# EAGLE schematic schmatic (EAGLE 9.6.2)

## Sheet 1 of 5
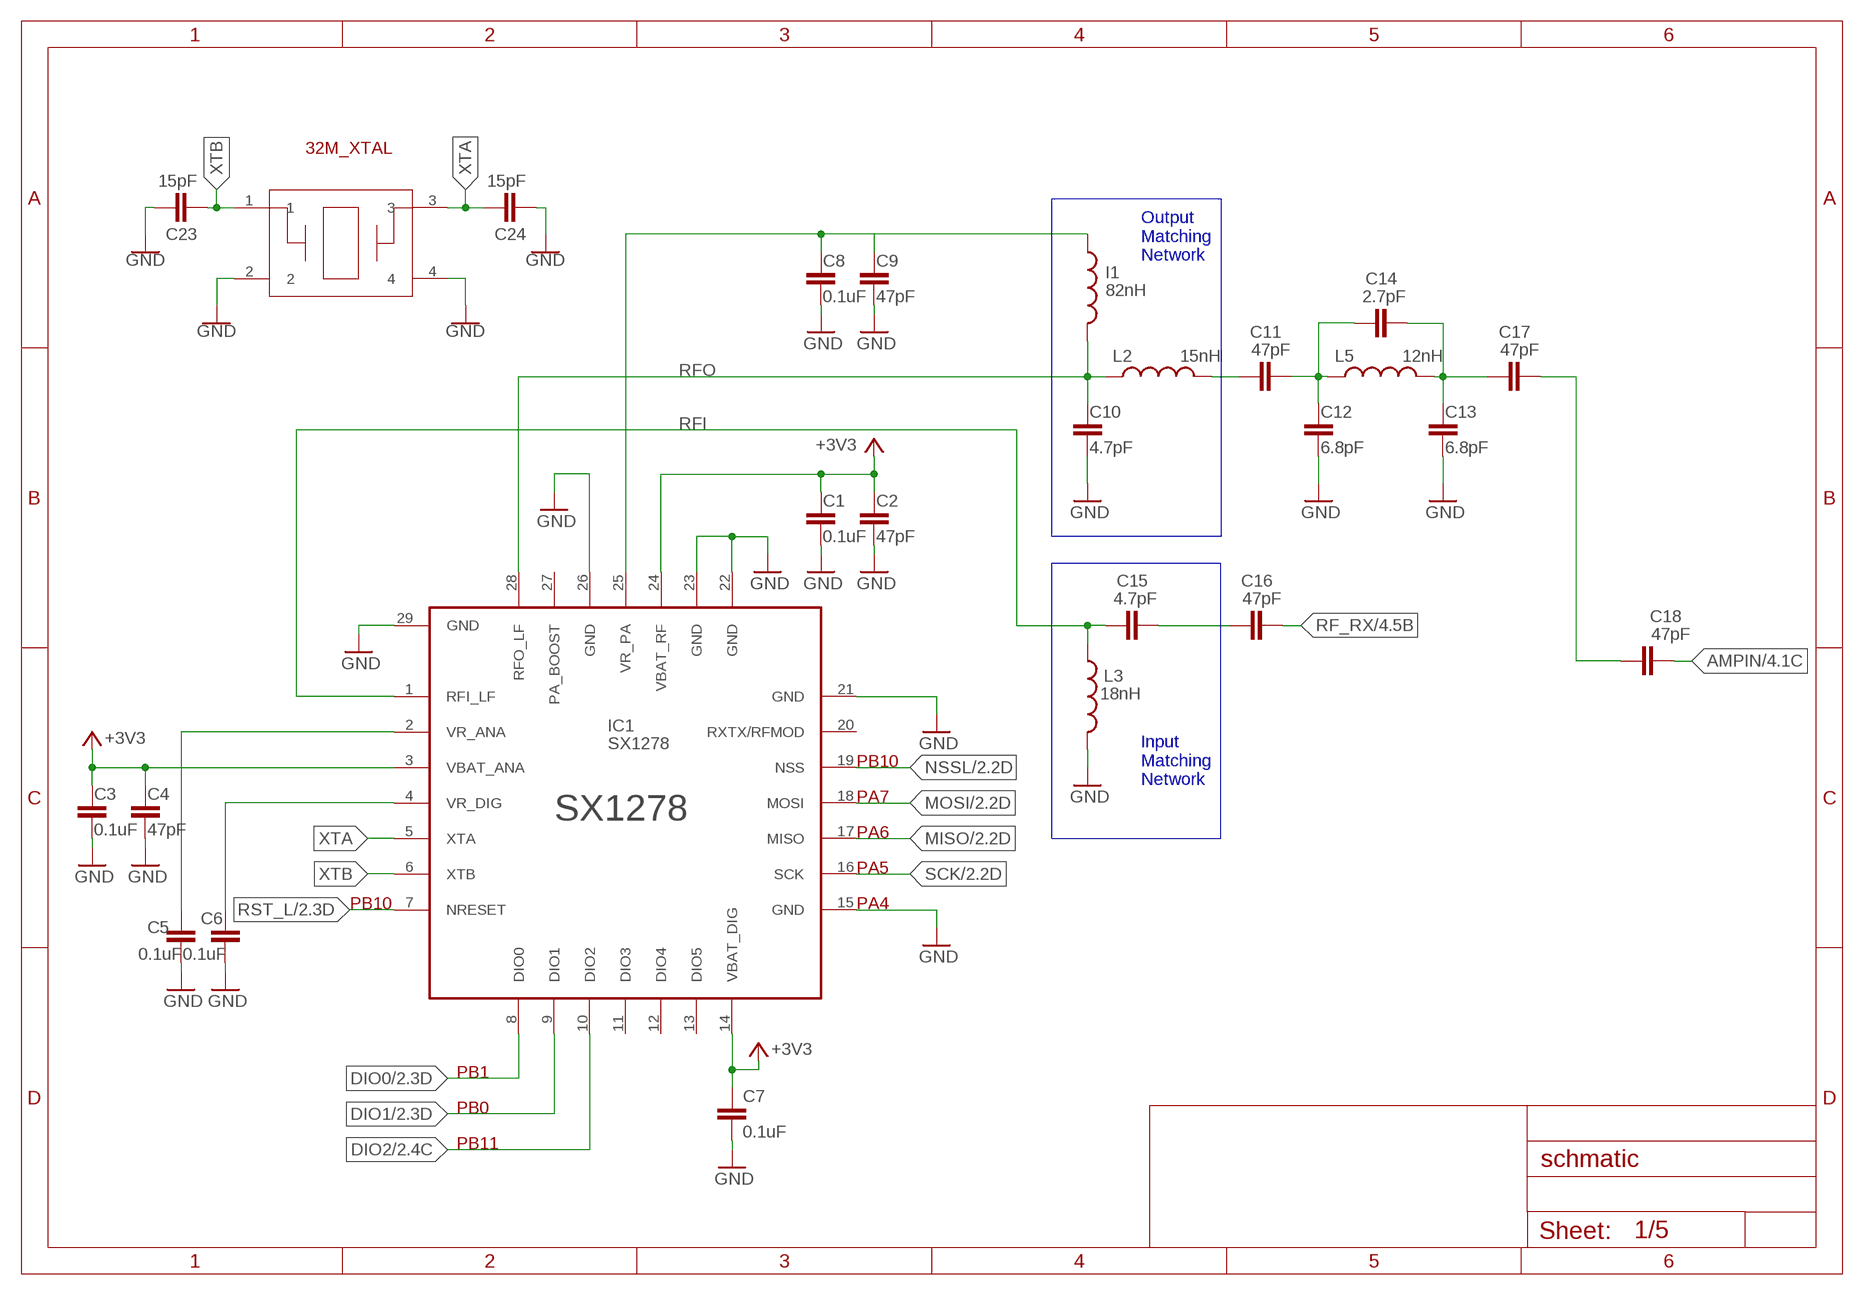
[diagram p0: schematic, sheet 1]

### Parts
C1  0.1uF  CAPACITOR  [M(1005)_US(0402)]
C2  47pF  CAPACITOR  [M(1005)_US(0402)]
C3  0.1uF  CAPACITOR  [M(1005)_US(0402)]
C4  47pF  CAPACITOR  [M(1005)_US(0402)]
C5  0.1uF  CAPACITOR  [M(1005)_US(0402)]
C6  0.1uF  CAPACITOR  [M(1005)_US(0402)]
C7  0.1uF  CAPACITOR  [M(1005)_US(0402)]
C8  0.1uF  CAPACITOR  [M(1005)_US(0402)]
C9  47pF  CAPACITOR  [M(1005)_US(0402)]
C10  4.7pF  CAPACITOR  [M(1005)_US(0402)]
C11  47pF  CAPACITOR  [M(1005)_US(0402)]
C12  6.8pF  CAPACITOR  [M(1005)_US(0402)]
C13  6.8pF  CAPACITOR  [M(1005)_US(0402)]
C14  2.7pF  CAPACITOR  [M(1005)_US(0402)]
C15  4.7pF  CAPACITOR  [M(1005)_US(0402)]
C16  47pF  CAPACITOR  [M(1005)_US(0402)]
C17  47pF  CAPACITOR  [M(1005)_US(0402)]
C18  47pF  CAPACITOR  [M(1005)_US(0402)]
C23  15pF  CAP_(M1005)_0402  [CAP_(M1005)_0402]
C24  15pF  CAP_(M1005)_0402  [CAP_(M1005)_0402]
I1  82nH  INDUCTOR1608  [M(1608)_US(0603)]
IC1  SX1278  [SX1278]
L2  15nH  INDUCTOR  [M(1005)_US(0402)]
L3  18nH  INDUCTOR  [M(1005)_US(0402)]
L5  12nH  INDUCTOR  [M(1005)_US(0402)]
Q1  NX2520SA-32MHZ  [NX2520SA]

### Nets
+3V1: C5.1 IC1.2(VR_ANA)
+3V2: C6.1 IC1.4(VR_DIG)
+3V3: C1.1 C2.1 C3.1 C4.1 C7.1 IC1.3(VBAT_ANA) IC1.14(VBAT_DIG) IC1.24(VBAT_RF) ; also sheet 2,3,4,5
+3V4: C8.1 C9.1 I1.1 IC1.25(VR_PA)
AMPIN: C18.2 ; also sheet 4
DIO0: IC1.8(DIO0) ; also sheet 2
DIO1: IC1.9(DIO1) ; also sheet 2
DIO2: IC1.10(DIO2) ; also sheet 2
GND: C1.2 C2.2 C3.2 C4.2 C5.2 C6.2 C7.2 C8.2 C9.2 C10.2 C12.2 C13.2 C23.1 C24.2 IC1.15(GND) IC1.21(GND) IC1.22(GND) IC1.23(GND) IC1.26(GND) IC1.29(GND) L3.2 Q1.2 Q1.4 ; also sheet 2,3,4,5
MISO: IC1.17(MISO) ; also sheet 2,3
MOSI: IC1.18(MOSI) ; also sheet 2,3
N$1: C11.1 L2.2
N$2: C11.2 C12.1 C14.1 L5.1
N$3: C13.1 C14.2 C17.1 L5.2
N$5: C15.2 C16.1
N$6: C17.2 C18.1
NSSL: IC1.19(NSS) ; also sheet 2
RF_RX: C16.2 ; also sheet 4
RFI: C15.1 IC1.1(RFI_LF) L3.1
RFO: C10.1 I1.2 IC1.28(RFO_LF) L2.1
RST_L: IC1.7(NRESET) ; also sheet 2
SCK: IC1.16(SCK) ; also sheet 2,3
XTA: C24.1 IC1.5(XTA) Q1.3
XTB: C23.2 IC1.6(XTB) Q1.1
Unconnected: IC1.11(DIO3) IC1.12(DIO4) IC1.13(DIO5) IC1.20(RXTX/RFMOD) IC1.27(PA_BOOST)

### Buses
B$1
B$2

### Notes on the sheet
- 32M_XTAL
- Output
  Matching
  Network
- PB10
- Input
  Matching
  Network
- PA7
- PA6
- PA5
- PB10 | PA4
- PB1
- PB0
- PB11

## Sheet 2 of 5
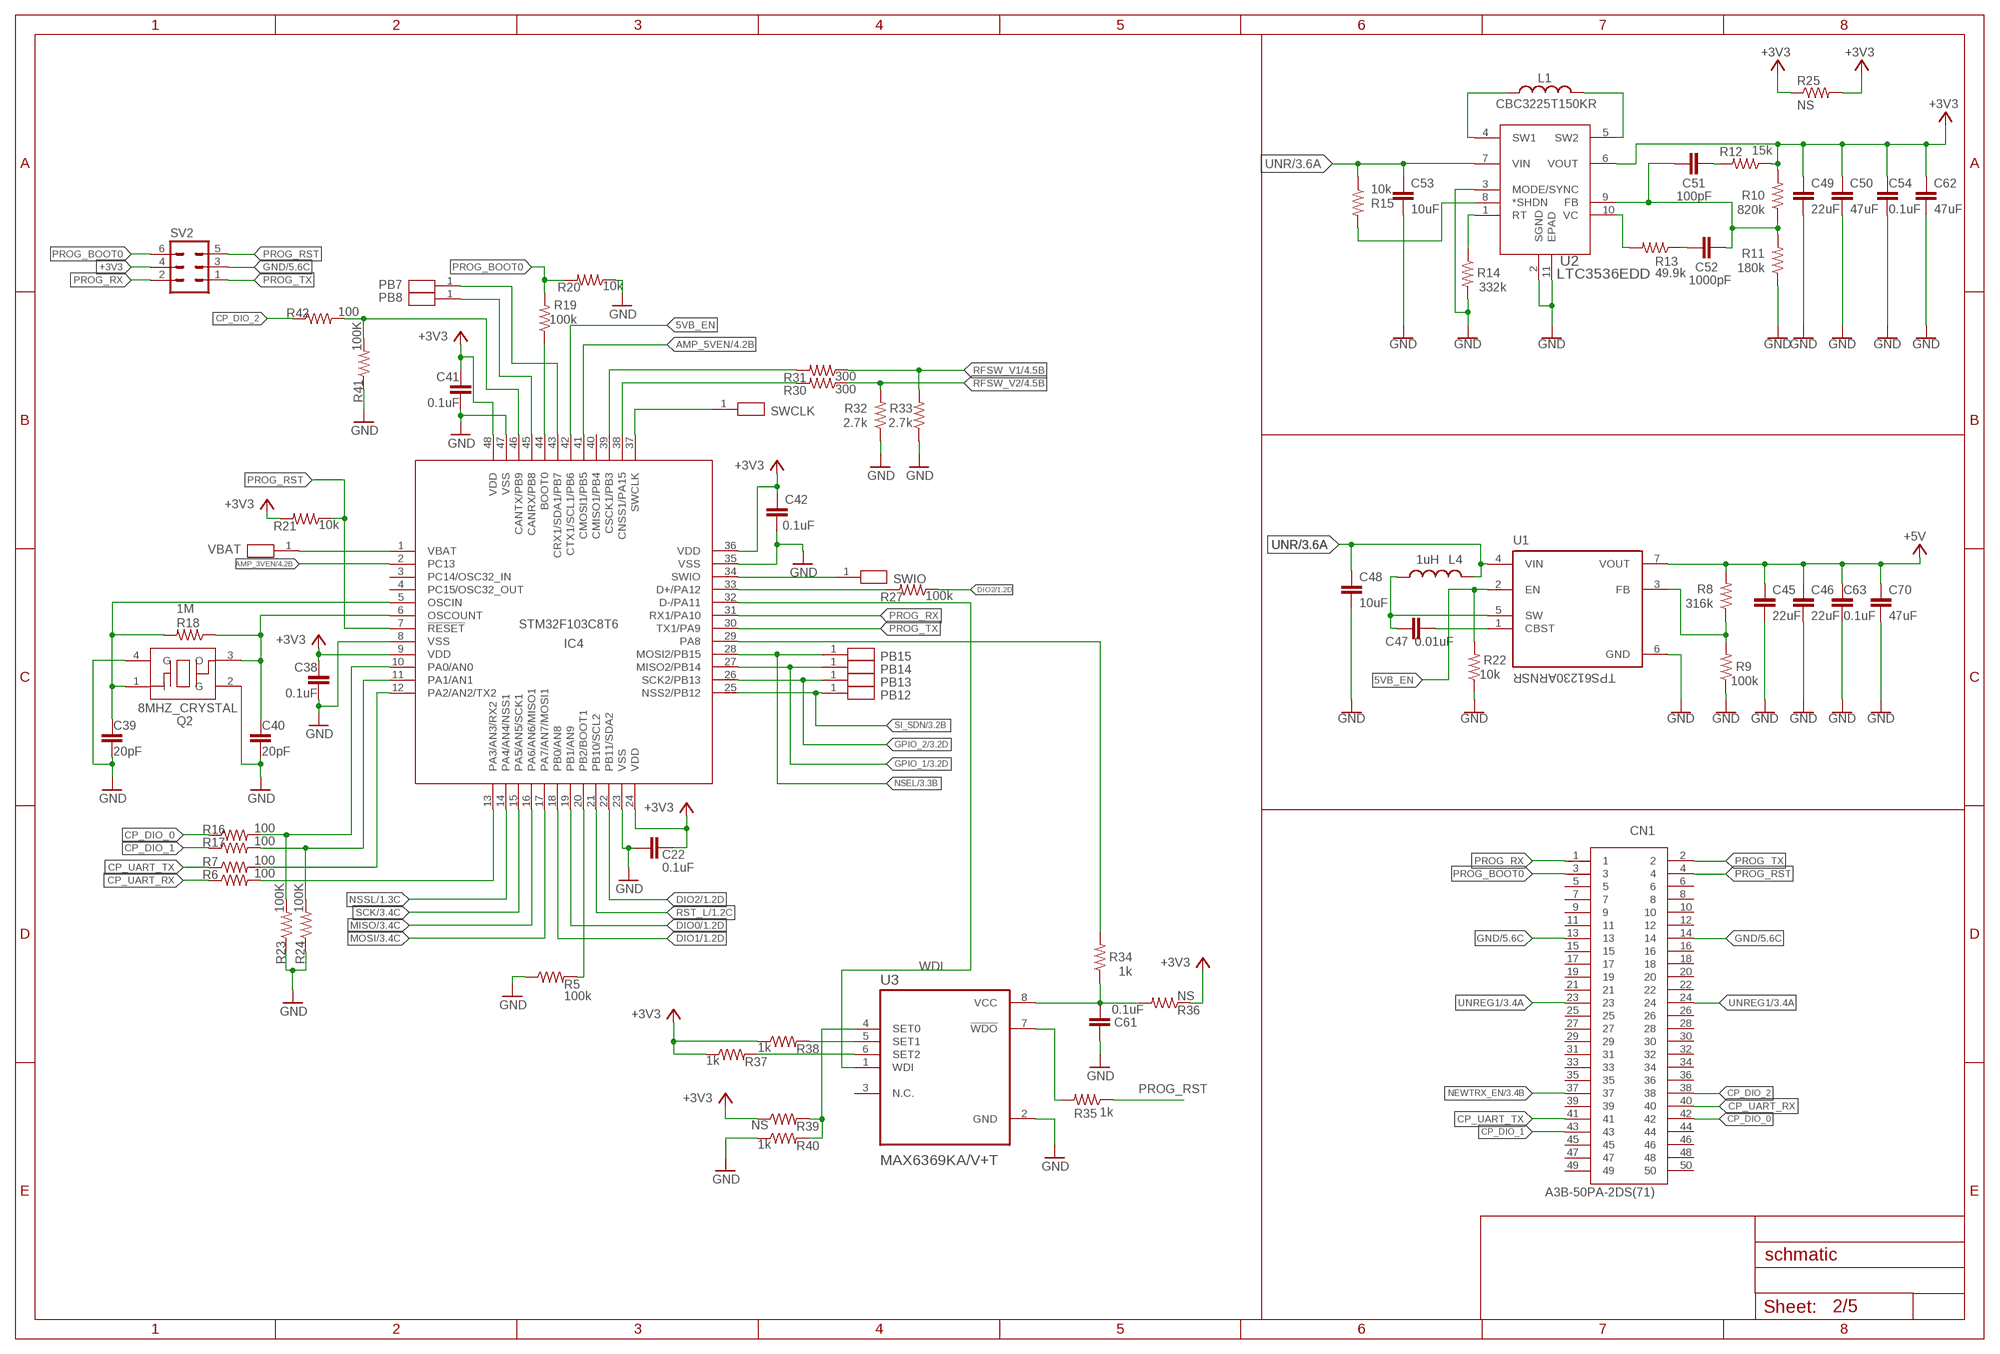
[diagram p1: schematic, sheet 2]

### Parts
C22  0.1uF  CAPACITOR  [M(1005)_US(0402)]
C38  0.1uF  CAPACITOR  [M(1005)_US(0402)]
C39  20pF  CAPACITOR  [M(1005)_US(0402)]
C40  20pF  CAPACITOR  [M(1005)_US(0402)]
C41  0.1uF  CAPACITOR  [M(1005)_US(0402)]
C42  0.1uF  CAPACITOR  [M(1005)_US(0402)]
C45  22uF  CAPACITOR1608  [M(1608)_US(0603)]
C46  22uF  CAPACITOR1608  [M(1608)_US(0603)]
C47  0.01uF  CAPACITOR  [M(1005)_US(0402)]
C48  10uF  CAPACITOR1608  [M(1608)_US(0603)]
C49  22uF  CAPACITOR1608  [M(1608)_US(0603)]
C50  47uF  CAPACITOR2012  [M(2012)_US(0805)]
C51  100pF  CAPACITOR  [M(1005)_US(0402)]
C52  1000pF  CAPACITOR  [M(1005)_US(0402)]
C53  10uF  CAPACITOR1608  [M(1608)_US(0603)]
C54  0.1uF  CAPACITOR  [M(1005)_US(0402)]
C61  0.1uF  CAPACITOR  [M(1005)_US(0402)]
C62  47uF  CAPACITOR2012  [M(2012)_US(0805)]
C63  0.1uF  CAPACITOR  [M(1005)_US(0402)]
C70  47uF  CAPACITOR2012  [M(2012)_US(0805)]
CN1  A3B-50PA-2DS(71)  [A3B-50PA-2DS(71)]
IC4  STM32F103C8T6  [STM32F103C8T6]
L1  CBC3225T150KR  INDUCTOR3225  [M(3225)_US(1210)]
L4  1uH  AMDLA3020S-1R5MT  [AMDLA3020S-1R5MT]
PB7  TEST_POINT  [TEST_POINT_1.5MM]
PB8  TEST_POINT  [TEST_POINT_1.5MM]
PB12  TEST_POINT  [TEST_POINT_1.5MM]
PB13  TEST_POINT  [TEST_POINT_1.5MM]
PB14  TEST_POINT  [TEST_POINT_1.5MM]
PB15  TEST_POINT  [TEST_POINT_1.5MM]
Q2  8MHZ_CRYSTAL  [ECS-80-18-30B-JEM-TR]
R5  100k  RESISTOR  [M(1005)_US(0402)]
R6  100  RESISTOR  [M(1005)_US(0402)]
R7  100  RESISTOR  [M(1005)_US(0402)]
R8  316k  RESISTOR1608  [M(1608)_US(0603)]
R9  100k  RESISTOR1608  [M(1608)_US(0603)]
R10  820k  RESISTOR1608  [M(1608)_US(0603)]
R11  180k  RESISTOR1608  [M(1608)_US(0603)]
R12  15k  RESISTOR1608  [M(1608)_US(0603)]
R13  49.9k  RESISTOR1608  [M(1608)_US(0603)]
R14  332k  RESISTOR1608  [M(1608)_US(0603)]
R15  10k  RESISTOR  [M(1005)_US(0402)]
R16  100  RESISTOR  [M(1005)_US(0402)]
R17  100  RESISTOR  [M(1005)_US(0402)]
R18  1M  RESISTOR1608  [M(1608)_US(0603)]
R19  100k  RESISTOR  [M(1005)_US(0402)]
R20  10k  RESISTOR  [M(1005)_US(0402)]
R21  10k  RESISTOR  [M(1005)_US(0402)]
R22  10k  RESISTOR  [M(1005)_US(0402)]
R23  100K  RESISTOR  [M(1005)_US(0402)]
R24  100K  RESISTOR  [M(1005)_US(0402)]
R25  NS  RESISTOR2012  [M(2012)_US(0805)]
R27  100k  RESISTOR  [M(1005)_US(0402)]
R30  300  RESISTOR1608  [M(1608)_US(0603)]
R31  300  RESISTOR1608  [M(1608)_US(0603)]
R32  2.7k  RESISTOR1608  [M(1608)_US(0603)]
R33  2.7k  RESISTOR1608  [M(1608)_US(0603)]
R34  1k  RESISTOR1608  [M(1608)_US(0603)]
R35  1k  RESISTOR1608  [M(1608)_US(0603)]
R36  NS  RESISTOR1608  [M(1608)_US(0603)]
R37  1k  RESISTOR  [M(1005)_US(0402)]
R38  1k  RESISTOR  [M(1005)_US(0402)]
R39  NS  RESISTOR  [M(1005)_US(0402)]
R40  1k  RESISTOR  [M(1005)_US(0402)]
R41  100K  RESISTOR  [M(1005)_US(0402)]
R42  100  RESISTOR  [M(1005)_US(0402)]
SV2  MA03-2  [MA03-2]
SWCLK  TEST_POINT  [TEST_POINT_1.5MM]
SWIO  TEST_POINT  [TEST_POINT_1.5MM]
U1  TPS61230ARNSR  [IC_TPS61230ARNSR]
U2  LTC3536EDD  LTC3536EDD#TRPBF  [DFN-10_DD]
U3  MAX6369KA/V+T  [SOT65P280X145-8N]
VBAT  TEST_POINT  [TEST_POINT_1.5MM]

### Nets
5VB_EN: IC4.42(CTX1/SCL1/PB6) R22.2 U1.2(EN)
+3V3: C22.1 C38.1 C41.1 C42.1 C49.1 C50.1 C54.1 C62.1 IC4.9(VDD) IC4.24(VDD) IC4.36(VDD) IC4.48(VDD) R10.2 R12.1 R21.2 R25.1 R25.2 R36.1 R37.1 R38.1 R39.1 SV2.4 U2.6(VOUT) ; also sheet 1,3,4,5
+5V: C45.1 C46.1 C63.1 C70.1 R8.2 U1.7(VOUT) ; also sheet 4
AMP_3VEN: IC4.2(PC13) ; also sheet 4
AMP_5VEN: IC4.41(CMOSI1/PB5) ; also sheet 4
C_UART_RX: IC4.13(PA3/AN3/RX2) R6.2
C_UART_TX: IC4.12(PA2/AN2/TX2) R7.2
CP_DIO_0: CN1.42 R16.1
CP_DIO_1: CN1.43 R17.1
CP_DIO_2: CN1.38 R42.1
CP_UART_RX: CN1.40 R6.1
CP_UART_TX: CN1.41 R7.1
DIO0: IC4.19(PB1/AN9) ; also sheet 1
DIO1: IC4.18(PB0/AN8) ; also sheet 1
DIO2: IC4.22(PB11/SDA2) R27.1 ; also sheet 1
GND: C22.2 C38.2 C39.2 C40.2 C41.2 C42.2 C45.2 C46.2 C48.2 C49.2 C50.2 C53.2 C54.2 C61.2 C62.2 C63.2 C70.2 CN1.13 CN1.14 IC4.8(VSS) IC4.23(VSS) IC4.35(VSS) IC4.47(VSS) Q2.2(G) Q2.4(G) R5.1 R9.1 R11.1 R14.2 R20.1 R22.1 R23.1 R24.1 R32.1 R33.1 R40.1 R41.1 SV2.3 U1.6(GND) U2.2(SGND) U2.3(MODE/SYNC) U2.11(EPAD) U3.2(GND) ; also sheet 1,3,4,5
GPIO_1: IC4.27(MISO2/PB14) PB14.1 ; also sheet 3
GPIO_2: IC4.26(SCK2/PB13) PB13.1 ; also sheet 3
MISO: IC4.16(PA6/AN6/MISO1) ; also sheet 1,3
MOSI: IC4.17(PA7/AN7/MOSI1) ; also sheet 1,3
N$17: IC4.38(CNSS1/PA15) R30.2
N$21: C61.1 R34.1 R36.2 U3.8(VCC)
N$24: IC4.10(PA0/AN0) R16.2 R23.2
N$25: IC4.20(PB2/BOOT1) R5.2
N$26: IC4.11(PA1/AN1) R17.2 R24.2
N$27: R35.2 U3.7(!WDO)
N$28: C39.1 IC4.5(OSCIN) Q2.1(I) R18.2
N$29: C40.1 IC4.6(OSCOUNT) Q2.3(O) R18.1
N$30: L1.1 U2.4(SW1)
N$31: R8.1 R9.2 U1.3(FB)
N$32: C47.1 L4.1 U1.5(SW)
N$33: L1.2 U2.5(SW2)
N$34: C47.2 U1.1(CBST)
N$35: IC4.1(VBAT) VBAT.1
N$36: C51.2 R12.2
N$37: C51.1 C52.2 R10.1 R11.2 U2.9(FB)
N$38: IC4.44(BOOT0) R19.1
N$39: C52.1 R13.1
N$40: R13.2 U2.10(VC)
N$41: R14.1 U2.1(RT)
N$42: R38.2 U3.5(SET1)
N$43: IC4.39(CSCK1/PB3) R31.2
N$44: R37.2 U3.6(SET2)
N$45: R39.2 R40.2 U3.4(SET0)
N$48: IC4.33(D+/PA12) R27.2
N$50: IC4.29(PA8) R34.2
NEWTRX_EN: CN1.37 ; also sheet 3
NSEL: IC4.28(MOSI2/PB15) PB15.1 ; also sheet 3
NSSL: IC4.14(PA4/AN4/NSS1) ; also sheet 1
NTRX_EN: R15.2 U2.8(*SHDN)
PB7: IC4.43(CRX1/SDA1/PB7) PB7.1
PB8: IC4.45(CANRX/PB8) PB8.1
PB9: IC4.46(CANTX/PB9) R41.2 R42.2
PROG_BOOT0: CN1.3 R19.2 R20.2 SV2.6
PROG_RST: CN1.4 IC4.7(!RESET) R21.1 R35.1 SV2.5
PROG_RX: CN1.1 IC4.31(RX1/PA10) SV2.2
PROG_TX: CN1.2 IC4.30(TX1/PA9) SV2.1
RFSW_V1: R31.1 R33.2 ; also sheet 4
RFSW_V2: R30.1 R32.2 ; also sheet 4
RST_L: IC4.21(PB10/SCL2) ; also sheet 1
SCK: IC4.15(PA5/AN5/SCK1) ; also sheet 1,3
SI_SDN: IC4.25(NSS2/PB12) PB12.1 ; also sheet 3
SWCLK: IC4.37(SWCLK) SWCLK.1
SWIO: IC4.34(SWIO) SWIO.1
UNR: C48.1 C53.1 L4.2 R15.1 U1.4(VIN) U2.7(VIN) ; also sheet 3
UNREG1: CN1.23 CN1.24 ; also sheet 3
WDI: IC4.32(D-/PA11) U3.1(WDI)
Unconnected: CN1.5 CN1.6 CN1.7 CN1.8 CN1.9 CN1.10 CN1.11 CN1.12 CN1.15 CN1.16 CN1.17 CN1.18 CN1.19 CN1.20 CN1.21 CN1.22 CN1.25 CN1.26 CN1.27 CN1.28 CN1.29 CN1.30 CN1.31 CN1.32 CN1.33 CN1.34 CN1.35 CN1.36 CN1.39 CN1.44 CN1.45 CN1.46 CN1.47 CN1.48 CN1.49 CN1.50 IC4.3(PC14/OSC32_IN) IC4.4(PC15/OSC32_OUT) IC4.40(CMISO1/PB4) U3.3(N.C.)

## Sheet 3 of 5
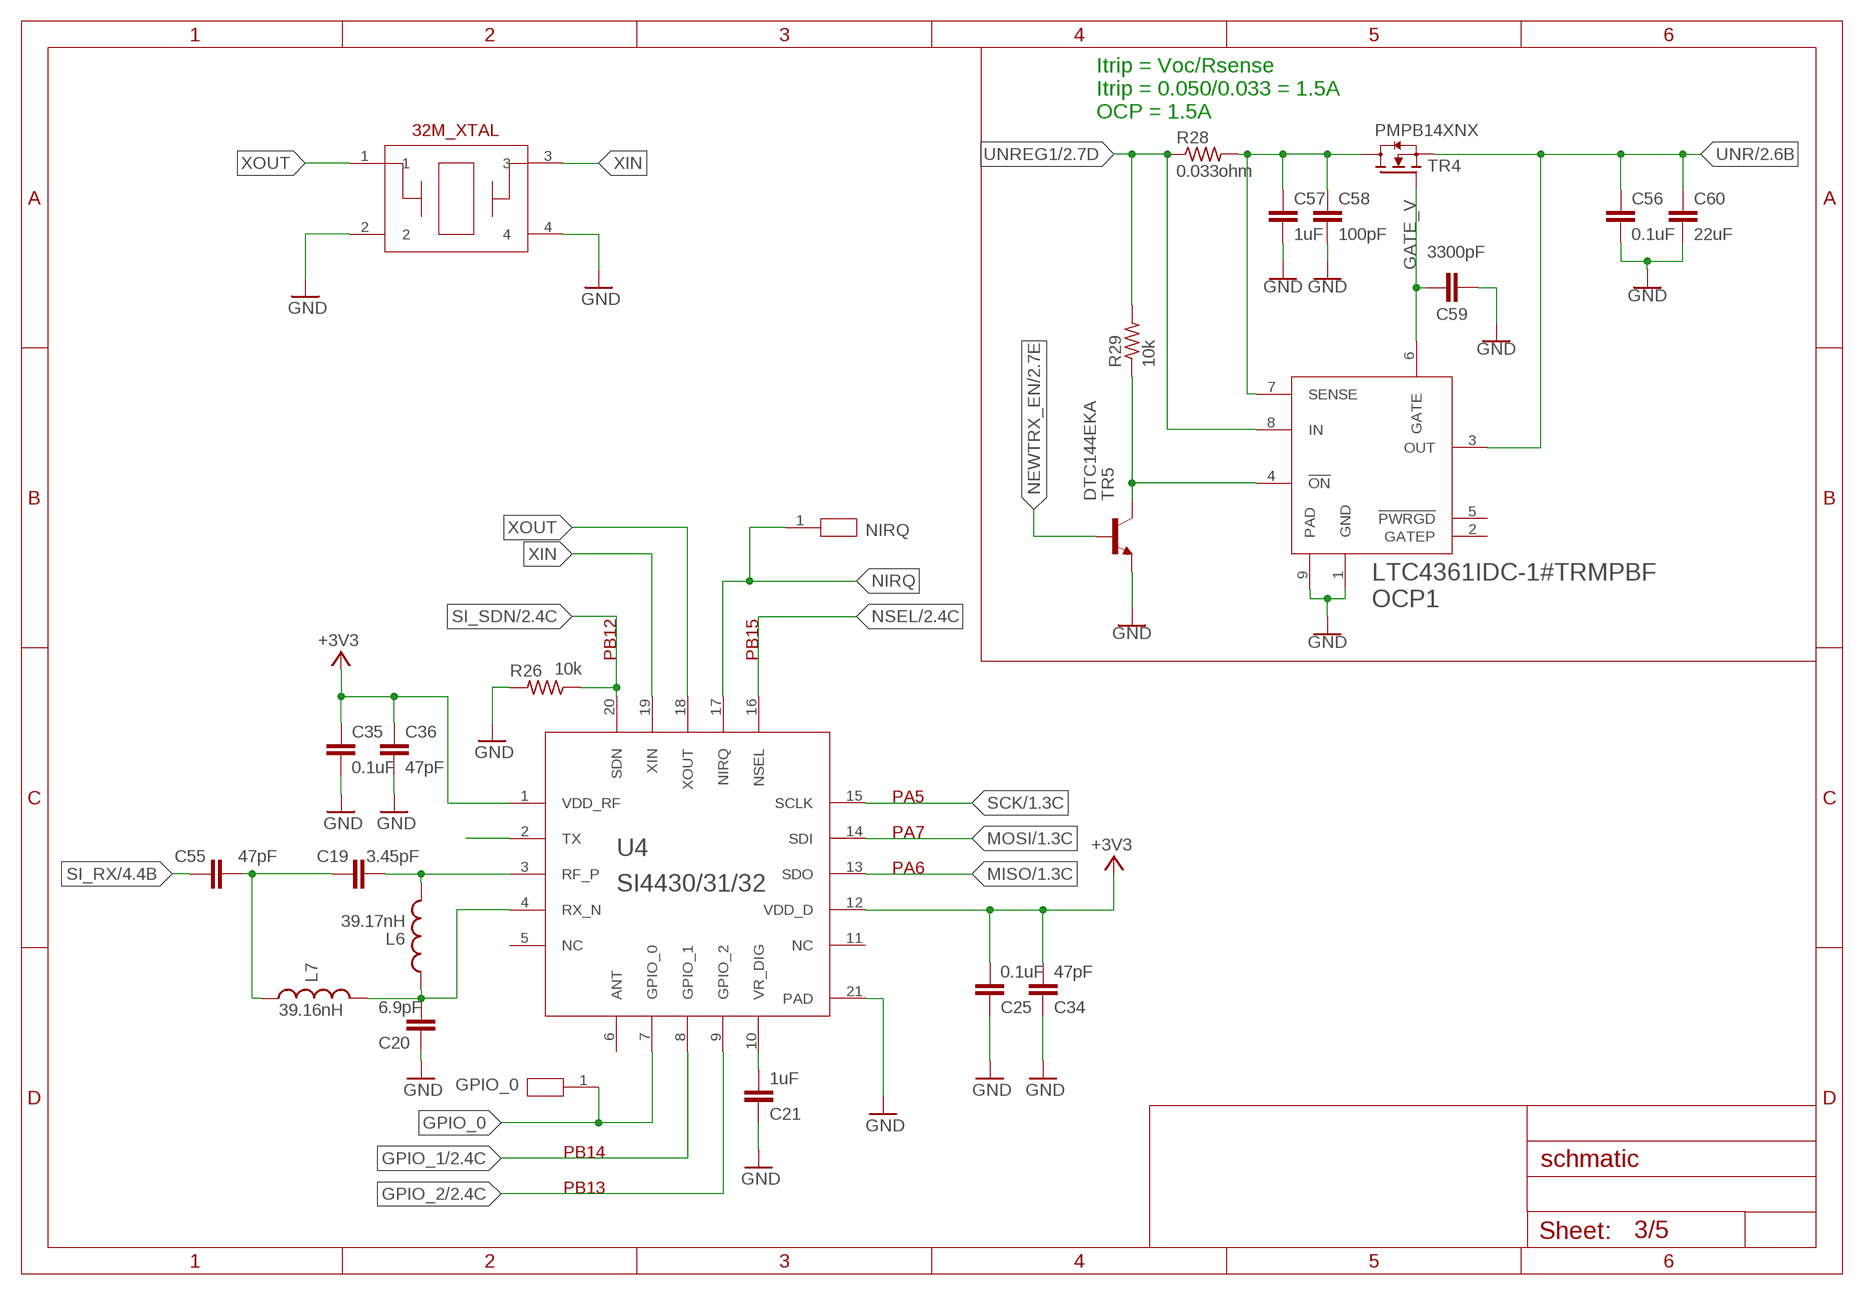
[diagram p2: schematic, sheet 3]

### Parts
C19  3.45pF  CAPACITOR  [M(1005)_US(0402)]
C20  6.9pF  CAPACITOR  [M(1005)_US(0402)]
C21  1uF  CAPACITOR  [M(1005)_US(0402)]
C25  0.1uF  CAPACITOR  [M(1005)_US(0402)]
C34  47pF  CAPACITOR  [M(1005)_US(0402)]
C35  0.1uF  CAPACITOR1608  [M(1608)_US(0603)]
C36  47pF  CAPACITOR1608  [M(1608)_US(0603)]
C55  47pF  CAPACITOR  [M(1005)_US(0402)]
C56  0.1uF  CAP_(M1005)_0402  [CAP_(M1005)_0402]
C57  1uF  CAP_(M1005)_0402  [CAP_(M1005)_0402]
C58  100pF  CAP_(M1005)_0402  [CAP_(M1005)_0402]
C59  3300pF  CAP_(M1005)_0402  [CAP_(M1005)_0402]
C60  22uF  CAPACITOR1608  [M(1608)_US(0603)]
GPIO_0  TEST_POINT  [TEST_POINT_1.5MM]
L6  39.17nH  INDUCTOR  [M(1005)_US(0402)]
L7  39.16nH  INDUCTOR  [M(1005)_US(0402)]
NIRQ  TEST_POINT  [TEST_POINT_1.5MM]
OCP1  LTC4361IDC-1#TRMPBF  [LTC4361IDC-1#TRMPBF]
Q3  NX2520SA-30MHZ  NX2520SA-32MHZ  [NX2520SA]
R26  10k  RESISTOR1608  [M(1608)_US(0603)]
R28  0.033ohm  R-US_R0805  [R0805]
R29  10k  RESISTOR  [RES_(M1005)_0402]
TR4  PMPB14XNX  [PMPB14XN]
TR5  DTC144EKA  [SOT346-R]
U4  SI4430/31/32  [SI4430/31/32]

### Nets
+3V3: C25.2 C34.2 C35.1 C36.1 U4.1(VDD_RF) U4.12(VDD_D) ; also sheet 1,2,4,5
GATE_V: C59.2 OCP1.6(GATE) TR4.3(G)
GND: C20.1 C21.1 C25.1 C34.1 C35.2 C36.2 C56.2 C57.2 C58.2 C59.1 C60.2 OCP1.1(GND) OCP1.9(PAD) Q3.2 Q3.4 R26.2 TR5.1(E) U4.21(PAD) ; also sheet 1,2,4,5
GPIO_0: GPIO_0.1 U4.7(GPIO_0)
GPIO_1: U4.8(GPIO_1) ; also sheet 2
GPIO_2: U4.9(GPIO_2) ; also sheet 2
MISO: U4.13(SDO) ; also sheet 1,2
MOSI: U4.14(SDI) ; also sheet 1,2
N$7: C19.1 C55.2 L7.1
N$8: C21.2 U4.10(VR_DIG)
N$10: C19.2 L6.2 U4.3(RF_P)
N$11: C20.2 L6.1 L7.2 U4.4(RX_N)
N$20: OCP1.4(!ON) R29.1 TR5.3(C)
N$62: C57.1 C58.1 OCP1.7(SENSE) R28.2 TR4.1(D) TR4.2(D) TR4.5(D) TR4.6(D) TR4.7(D)
N$134: U4.2(TX)
NEWTRX_EN: TR5.2(B) ; also sheet 2
NIRQ: NIRQ.1 U4.17(NIRQ)
NSEL: U4.16(NSEL) ; also sheet 2
SCK: U4.15(SCLK) ; also sheet 1,2
SI_RX: C55.1 ; also sheet 4
SI_SDN: R26.1 U4.20(SDN) ; also sheet 2
UNR: C56.1 C60.1 OCP1.3(OUT) TR4.4(S) TR4.8(S) ; also sheet 2
UNREG1: OCP1.8(IN) R28.1 R29.2 ; also sheet 2
XIN: Q3.3 U4.19(XIN)
XOUT: Q3.1 U4.18(XOUT)
Unconnected: OCP1.2(GATEP) OCP1.5(!PWRGD) U4.5(NC) U4.6(ANT) U4.11(NC)

### Notes on the sheet
- Itrip = Voc/Rsense
  Itrip = 0.050/0.033 = 1.5A
  OCP = 1.5A
- 32M_XTAL
- PB12 | PB15
- PA5
- PA7
- PA6
- PB14
- PB13

## Sheet 4 of 5
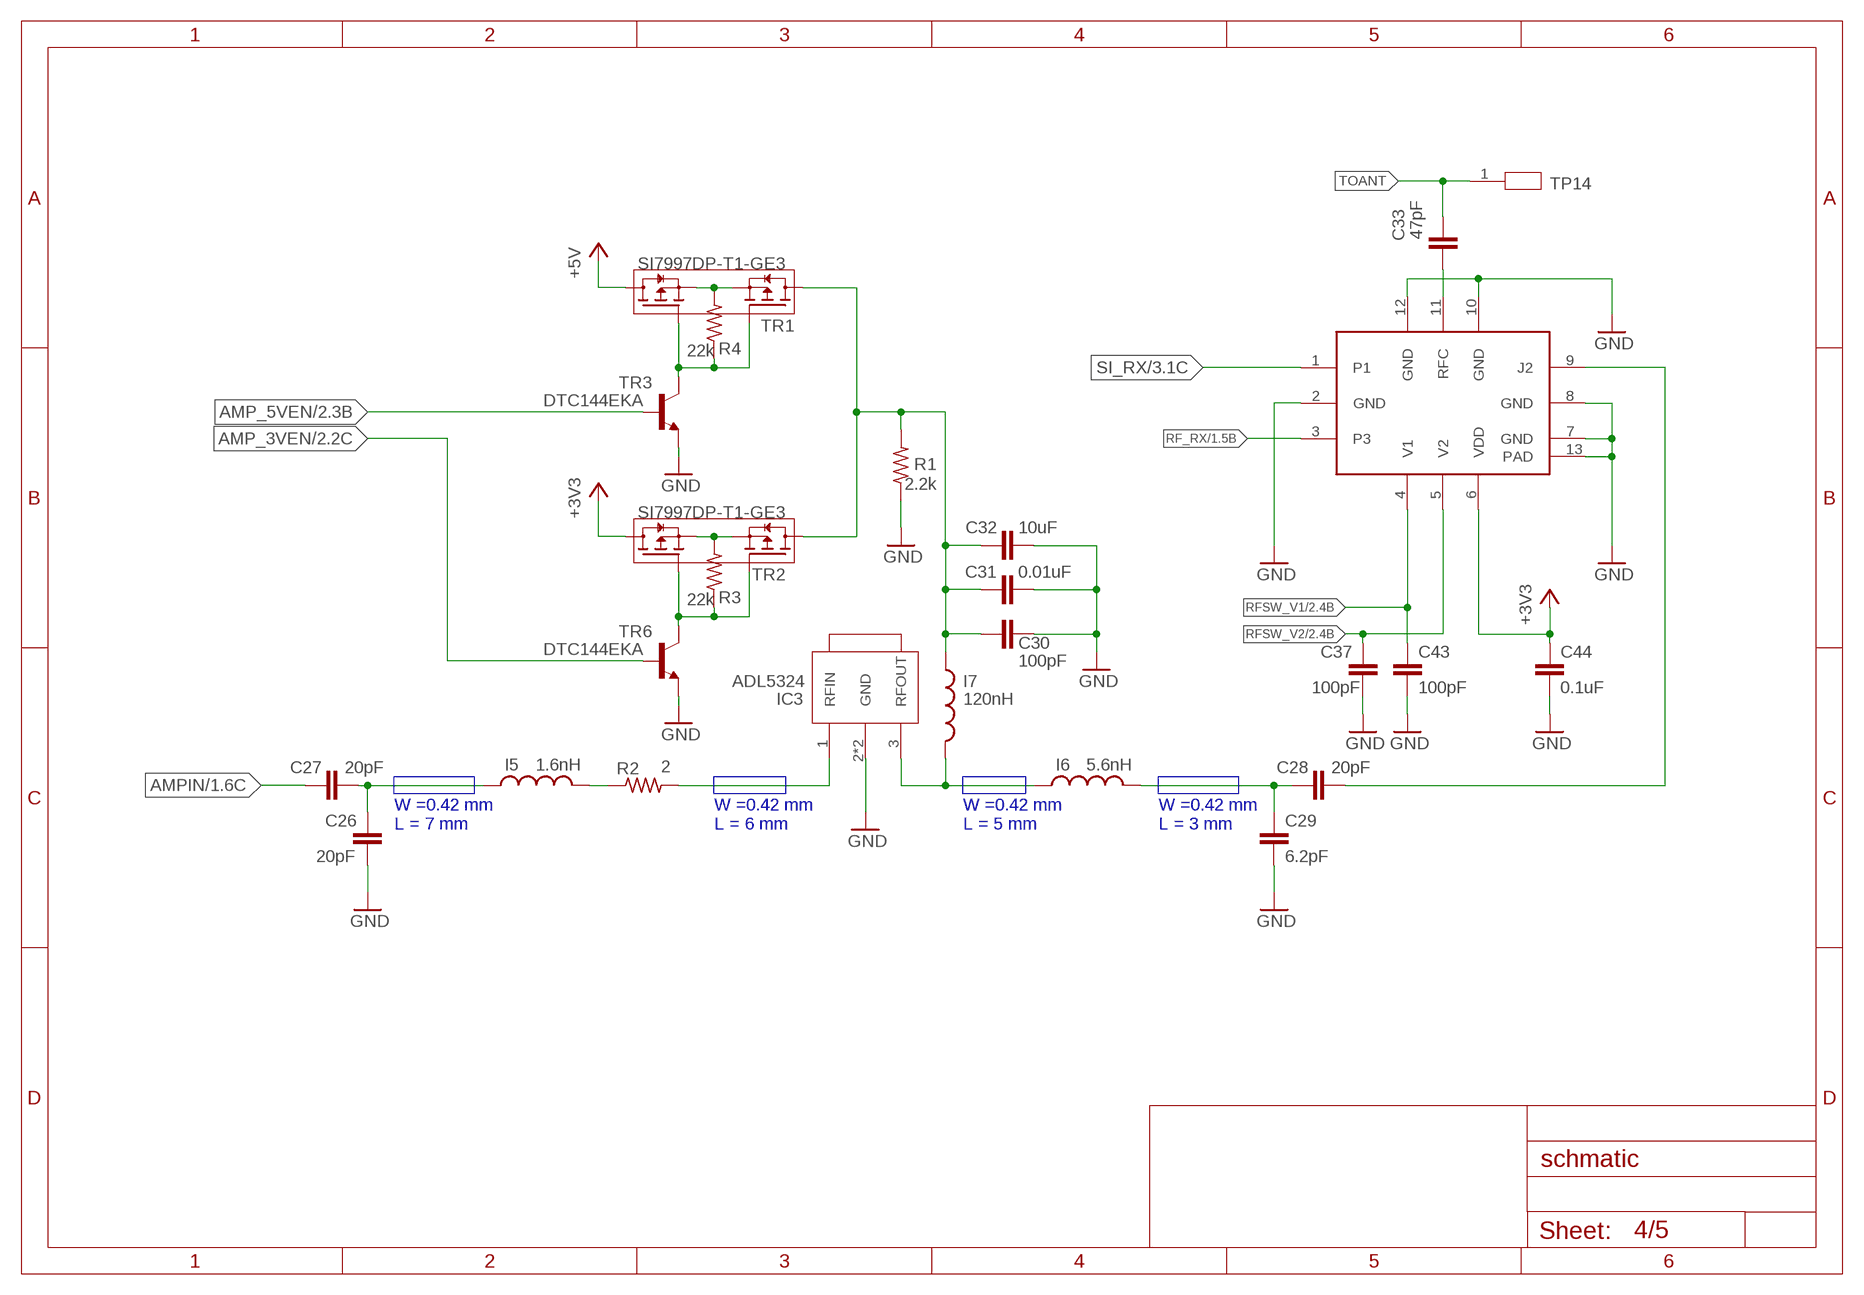
[diagram p3: schematic, sheet 4]

### Parts
C26  20pF  CAPACITOR  [M(1005)_US(0402)]
C27  20pF  CAPACITOR  [M(1005)_US(0402)]
C28  20pF  CAPACITOR  [M(1005)_US(0402)]
C29  6.2pF  CAPACITOR  [M(1005)_US(0402)]
C30  100pF  CAPACITOR  [M(1005)_US(0402)]
C31  0.01uF  CAPACITOR  [M(1005)_US(0402)]
C32  10uF  CAPACITOR1608  [M(1608)_US(0603)]
C33  47pF  CAPACITOR  [M(1005)_US(0402)]
C37  100pF  CAPACITOR  [M(1005)_US(0402)]
C43  100pF  CAPACITOR  [M(1005)_US(0402)]
C44  0.1uF  CAPACITOR  [M(1005)_US(0402)]
I5  1.6nH  INDUCTOR  [M(1005)_US(0402)]
I6  5.6nH  INDUCTOR  [M(1005)_US(0402)]
I7  120nH  INDUCTOR2012  [M(2012)_US(0805)]
IC3  ADL5324  [ADL5324]
R1  2.2k  RESISTOR1608  [M(1608)_US(0603)]
R2  2  RESISTOR1608  [M(1608)_US(0603)]
R3  22k  RESISTOR1608  [M(1608)_US(0603)]
R4  22k  RESISTOR1608  [M(1608)_US(0603)]
SW1  SKY13373-460LF  [SKY13373-460LF]
TP14  TEST_POINT  [TEST_POINT_1.5MM]
TR1  SI7997DP-T1-GE3  [SI7997DP-T1-GE3]
TR2  SI7997DP-T1-GE3  [SI7997DP-T1-GE3]
TR3  DTC144EKA  [SOT346-R]
TR6  DTC144EKA  [SOT346-R]

### Nets
+3V3: C44.1 SW1.6(VDD) TR2.7(D1) TR2.8(D1) TR2.10(D1) ; also sheet 1,2,3,5
+5V: TR1.7(D1) TR1.8(D1) TR1.10(D1) ; also sheet 2
AMP_3VEN: TR6.2(B) ; also sheet 2
AMP_5VEN: TR3.2(B) ; also sheet 2
AMPIN: C27.1 ; also sheet 1
AMPPWR: C30.2 C31.2 C32.1 I7.1 R1.2 TR1.5(D2) TR1.6(D2) TR1.9(D2) TR2.5(D2) TR2.6(D2) TR2.9(D2)
GND: C26.2 C29.2 C30.1 C31.1 C32.2 C37.2 C43.2 C44.2 IC3.2(GND) IC3.4(GND) R1.1 SW1.2(GND) SW1.7(GND) SW1.8(GND) SW1.10(GND) SW1.12(GND) SW1.13(PAD) TR3.1(E) TR6.1(E) ; also sheet 1,2,3,5
N$4: C33.1 SW1.11(RFC)
N$9: C26.1 C27.2 I5.1
N$12: I5.2 R2.1
N$13: IC3.1(RFIN) R2.2
N$14: I6.1 I7.2 IC3.3(RFOUT)
N$15: C28.1 C29.1 I6.2
N$16: C28.2 SW1.9(J2)
N$18: R4.2 TR1.1(S1) TR1.3(S2)
N$19: R3.2 TR2.1(S1) TR2.3(S2)
N$22: R4.1 TR1.2(G1) TR1.4(G2) TR3.3(C)
N$23: R3.1 TR2.2(G1) TR2.4(G2) TR6.3(C)
RF_RX: SW1.3 ; also sheet 1
RFSW_V1: C43.1 SW1.4(V1) ; also sheet 2
RFSW_V2: C37.1 SW1.5(V2) ; also sheet 2
SI_RX: SW1.1 ; also sheet 3
TOANT: C33.2 TP14.1

### Buses
B$3
B$4
B$5
B$6

### Notes on the sheet
- W =0.42 mm
  L = 7 mm
- W =0.42 mm
  L = 6 mm
- W =0.42 mm
  L = 5 mm
- W =0.42 mm
  L = 3 mm

## Sheet 5 of 5
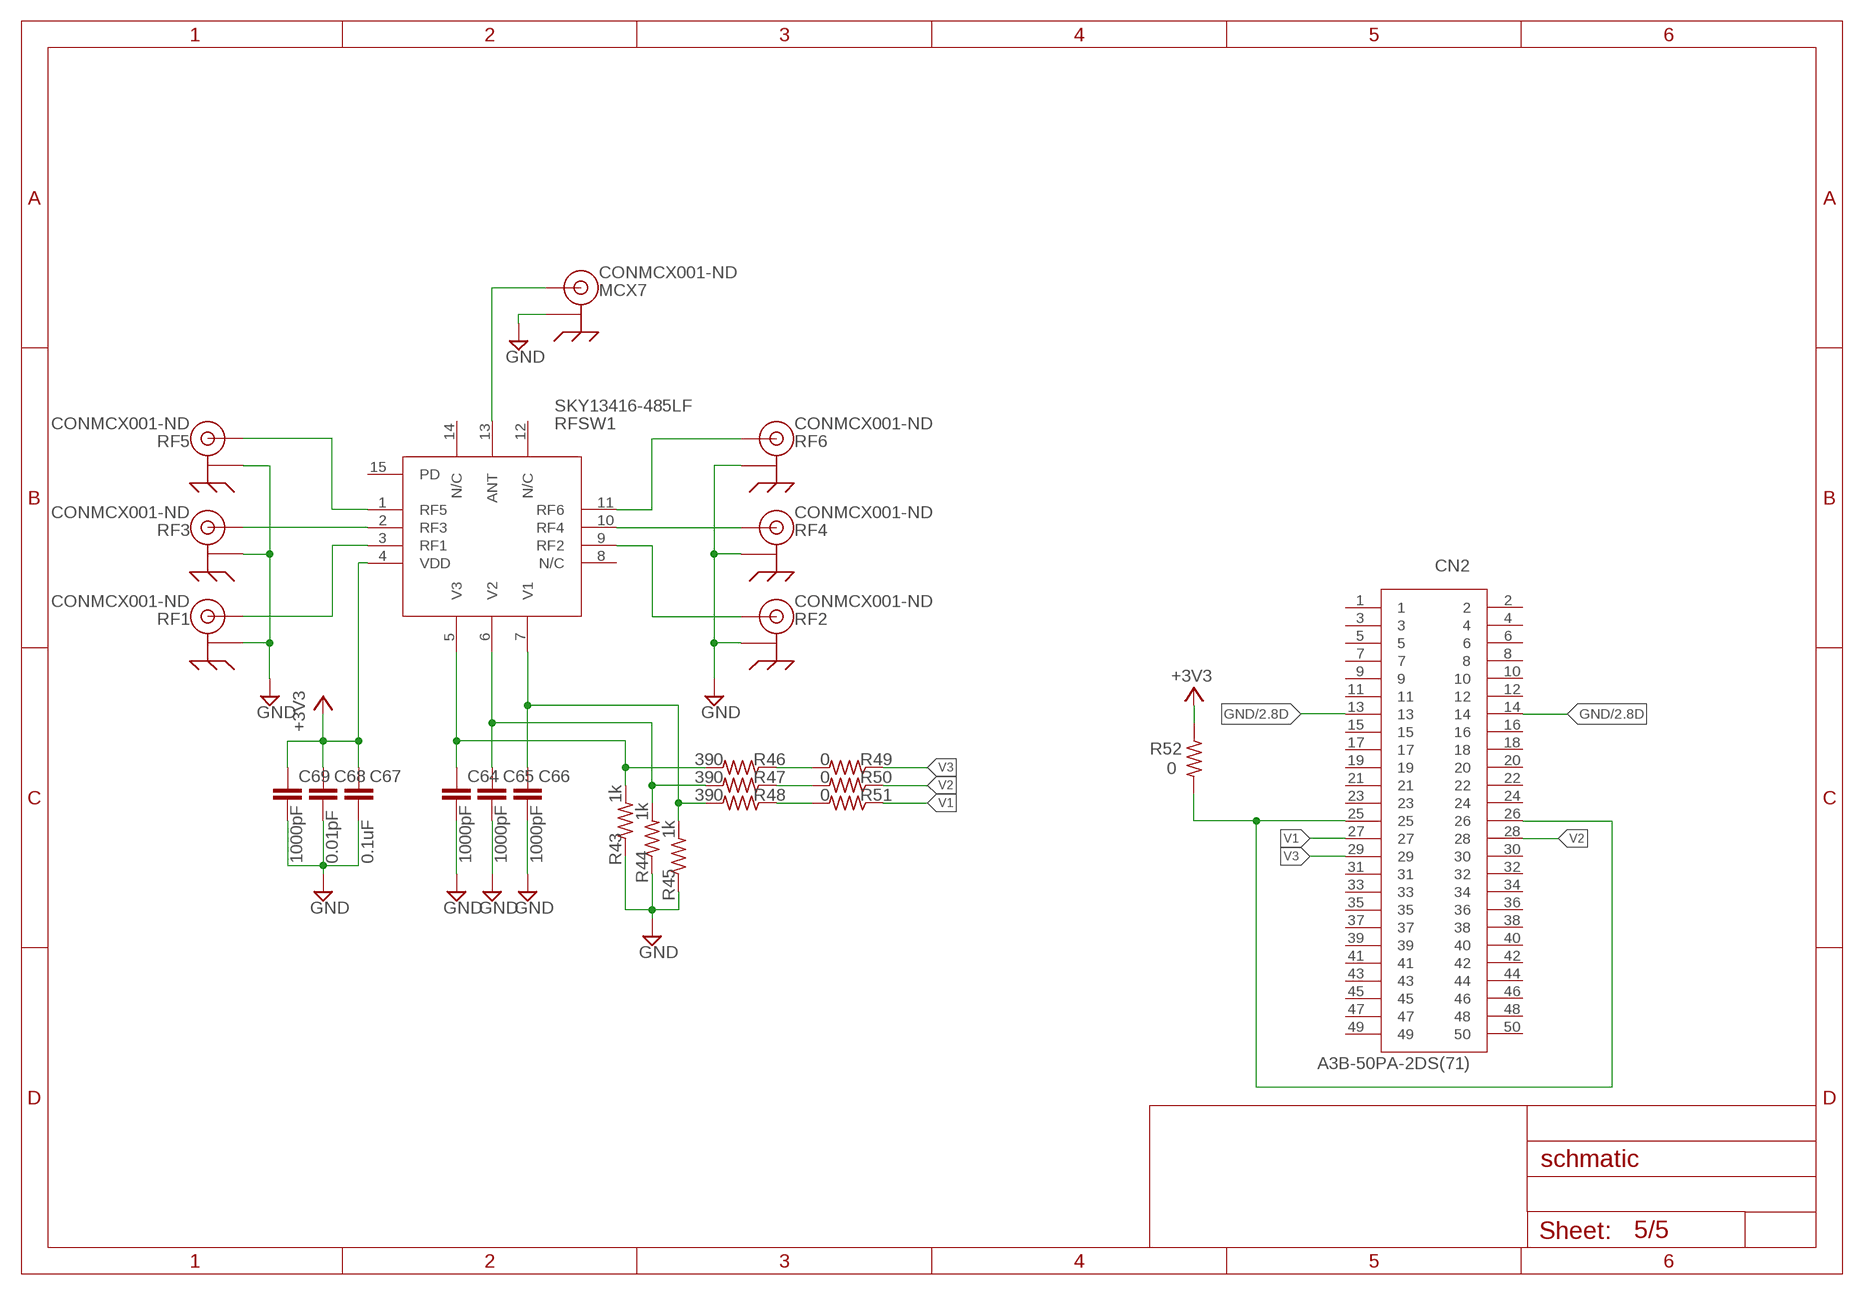
[diagram p4: schematic, sheet 5]

### Parts
C64  1000pF  CAPACITOR  [M(1005)_US(0402)]
C65  1000pF  CAPACITOR  [M(1005)_US(0402)]
C66  1000pF  CAPACITOR  [M(1005)_US(0402)]
C67  0.1uF  CAPACITOR  [M(1005)_US(0402)]
C68  0.01pF  CAPACITOR  [M(1005)_US(0402)]
C69  1000pF  CAPACITOR  [M(1005)_US(0402)]
CN2  A3B-50PA-2DS(71)  [A3B-50PA-2DS(71)]
MCX7  CONMCX001-ND  [CONMCX001-ND]
R43  1k  RESISTOR1608  [M(1608)_US(0603)]
R44  1k  RESISTOR1608  [M(1608)_US(0603)]
R45  1k  RESISTOR1608  [M(1608)_US(0603)]
R46  390  RESISTOR1608  [M(1608)_US(0603)]
R47  390  RESISTOR1608  [M(1608)_US(0603)]
R48  390  RESISTOR1608  [M(1608)_US(0603)]
R49  0  RESISTOR1608  [M(1608)_US(0603)]
R50  0  RESISTOR1608  [M(1608)_US(0603)]
R51  0  RESISTOR1608  [M(1608)_US(0603)]
R52  0  RESISTOR1608  [M(1608)_US(0603)]
RF1  CONMCX001-ND  [CONMCX001-ND]
RF2  CONMCX001-ND  [CONMCX001-ND]
RF3  CONMCX001-ND  [CONMCX001-ND]
RF4  CONMCX001-ND  [CONMCX001-ND]
RF5  CONMCX001-ND  [CONMCX001-ND]
RF6  CONMCX001-ND  [CONMCX001-ND]
RFSW1  SKY13416-485LF  [SKY13416-485LF]

### Nets
+3V3: C67.1 C68.1 C69.1 R52.1 RFSW1.4(VDD) ; also sheet 1,2,3,4
GND: C64.2 C65.2 C66.2 C67.2 C68.2 C69.2 CN2.13 CN2.14 MCX7.2 MCX7.3 MCX7.4 MCX7.5 R43.1 R44.1 R45.1 RF1.2 RF1.3 RF1.4 RF1.5 RF2.2 RF2.3 RF2.4 RF2.5 RF3.2 RF3.3 RF3.4 RF3.5 RF4.2 RF4.3 RF4.4 RF4.5 RF5.2 RF5.3 RF5.4 RF5.5 RF6.2 RF6.3 RF6.4 RF6.5 ; also sheet 1,2,3,4
N$120: RF4.1 RFSW1.10(RF4)
N$121: RF6.1 RFSW1.11(RF6)
N$122: RF2.1 RFSW1.9(RF2)
N$123: RF3.1 RFSW1.2(RF3)
N$124: RF5.1 RFSW1.1(RF5)
N$125: RF1.1 RFSW1.3(RF1)
N$126: MCX7.1 RFSW1.13(ANT)
N$127: C64.1 R43.2 R46.2 RFSW1.5(V3)
N$128: C65.1 R44.2 R47.2 RFSW1.6(V2)
N$129: C66.1 R45.2 R48.2 RFSW1.7(V1)
N$130: R46.1 R49.2
N$131: R47.1 R50.2
N$132: R48.1 R51.2
N$133: CN2.25 CN2.26 R52.2
V1: CN2.27 R51.1
V2: CN2.28 R50.1
V3: CN2.29 R49.1
Unconnected: CN2.1 CN2.2 CN2.3 CN2.4 CN2.5 CN2.6 CN2.7 CN2.8 CN2.9 CN2.10 CN2.11 CN2.12 CN2.15 CN2.16 CN2.17 CN2.18 CN2.19 CN2.20 CN2.21 CN2.22 CN2.23 CN2.24 CN2.30 CN2.31 CN2.32 CN2.33 CN2.34 CN2.35 CN2.36 CN2.37 CN2.38 CN2.39 CN2.40 CN2.41 CN2.42 CN2.43 CN2.44 CN2.45 CN2.46 CN2.47 CN2.48 CN2.49 CN2.50 RFSW1.8(N/C) RFSW1.12(N/C) RFSW1.14(N/C) RFSW1.15(PD)

## Library data of the parts
C1-C22 C25-C55 C60-C70 = Tharindu_lib:CAPACITOR
C23 C24 C56-C59 = Tharindu:CAP_(M1005)_0402
CN1 CN2 = Tharindu1:A3B-50PA-2DS(71)
GPIO_0 NIRQ PB7 PB8 PB12-PB15 SWCLK SWIO TP14 VBAT = Tharindu:TEST_POINT
I1 I5-I7 L1-L3 L5-L7 = Tharindu_lib:INDUCTOR
IC1 = Tharindu:SX1278
IC3 = Tharindu:ADL5324
IC4 = Tharindu:STM32F103C8T6
L4 = Tharindu:AMDLA3020S-1R5MT
MCX7 RF1-RF6 = Tharindu:CONMCX001-ND
OCP1 = Tharindu:LTC4361IDC-1#TRMPBF
Q1 Q3 = Tharindu:NX2520SA-32MHZ
Q2 = Tharindu:8MHZ_CRYSTAL
R1-R27 R30-R52 = Tharindu_lib:RESISTOR
R28 = adafruit:R-US_: RESISTOR, American symbol
R29 = Tharindu:RESISTOR
RFSW1 = Tharindu:SKY13416-485LF
SV2 = con-lstb:MA03-2: PIN HEADER; OC_FARNELL: unknown; OC_NEWARK: unknown
SW1 = Tharindu:SKY13373-460LF
TR1 TR2 = Tharindu:SI7997DP-T1-GE3
TR3 TR5 TR6 = BIRDS3_CAM_MSN:DTC144EKA
TR4 = Tharindu:PMPB14XNX
U1 = TPS61230ARNSR:TPS61230ARNSR: Boost Switching Regulator IC Positive Adjustable 2.5V 1 Output 6A (Switch) 7-VFQFN Check availability <https://pricing.snapeda.com/parts/TPS61230ARNSR/Texas%20Instruments/view-part?ref=eda>; AVAILABILITY: In Stock; DESCRIPTION: 5-V/6-A High Efficiency Step-Up Converter in 2.0-mm x 2.0-mm QFN Package; MF: Texas Instruments; MP: TPS61230ARNSR; PACKAGE: VQFN-HR-7 Texas Instruments; PRICE: None; PURCHASE-URL: https://pricing.snapeda.com/search/part/TPS61230ARNSR/?ref=eda
U2 = LTC3536EDD_TRPBF:LTC3536EDD#TRPBF: Check availability <https://pricing.snapeda.com/parts/LTC3536EDD%23TRPBF/Analog%20Devices/view-part?ref=eda>; AVAILABILITY: In Stock; DESCRIPTION: 1A Low Noise, Buck-Boost DC/DC Converter; MF: Analog Devices; MP: LTC3536EDD#TRPBF; PACKAGE: DFN -10 Analog Devices; PRICE: None; PURCHASE-URL: https://pricing.snapeda.com/search/part/LTC3536EDD#TRPBF/?ref=eda
U3 = MAX6369KA_V_T:MAX6369KA/V+T: Check availability <https://pricing.snapeda.com/parts/MAX6369KA/V%2BT/Analog%20Devices/view-part?ref=eda>; AVAILABILITY: In Stock; CHECK_PRICES: https://www.snapeda.com/parts/MAX6369KA/V+T/Analog+Devices/view-part/?ref=eda; DESCRIPTION: Pin-Selectable Watchdog Timers; MF: Analog Devices; MP: MAX6369KA/V+T; PACKAGE: SOT-8 Maxim; PRICE: None; PURCHASE-URL: https://pricing.snapeda.com/search?q=MAX6369KA/V+T&ref=eda; SNAPEDA_LINK: https://www.snapeda.com/parts/MAX6369KA/V+T/Analog+Devices/view-part/?ref=snap
U4 = Tharindu:SI4430/31/32

## Net classes
0 default: width 0.127 mm, drill 0.33 mm, clearance 0.203 mm
1 all: width 0.203 mm
2 gnd: width 0.305 mm, drill 0.33 mm, clearance 0.203 mm
3 power usb: width 0.508 mm, drill 0.33 mm, clearance 0.203 mm